# EAGLE design final (EAGLE 6.4)
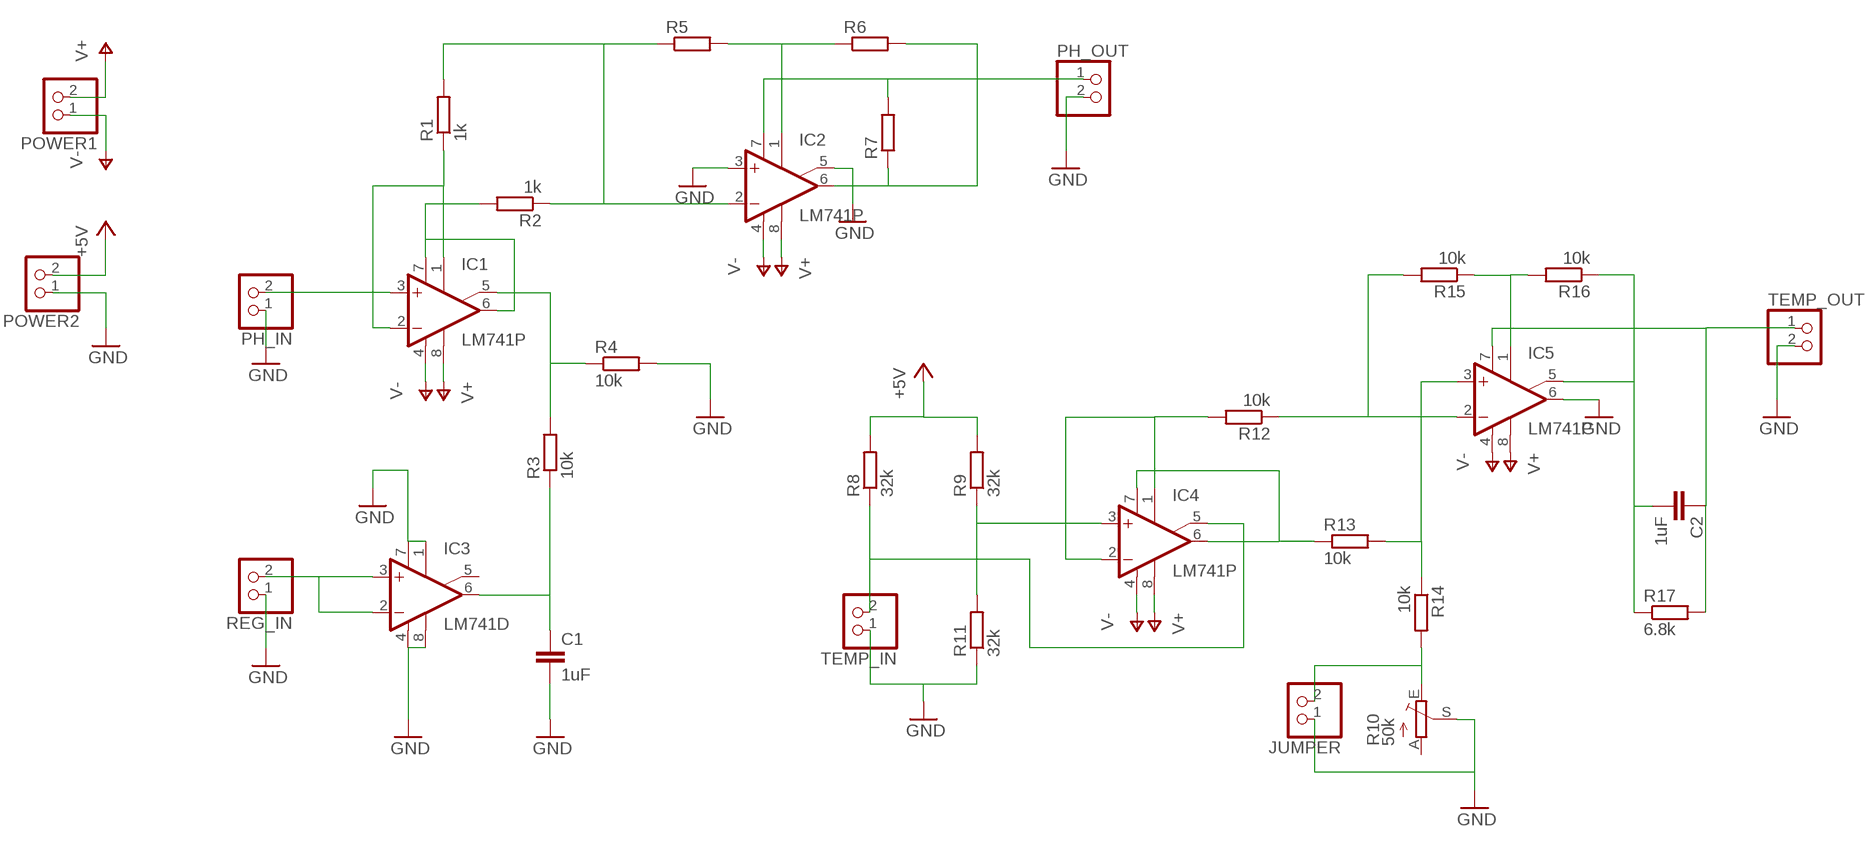
[diagram p0: schematic, sheet 1]

## Parts
C1  1uF  C-EUC0805K  [C0805K]
C2  1uF  C-EUC0805K  [C0805K]
IC1  LM741P  [DIL08]
IC2  LM741P  [DIL08]
IC3  LM741D  [SO08]
IC4  LM741P  [DIL08]
IC5  LM741P  [DIL08]
JUMPER  PINHD-1X2  [1X02]
PH_IN  PINHD-1X2  [1X02]
PH_OUT  PINHD-1X2  [1X02]
POWER1  PINHD-1X2  [1X02]
POWER2  PINHD-1X2  [1X02]
R1  1k  R-EU_R0805  [R0805]
R2  1k  R-EU_R0805  [R0805]
R3  10k  R-EU_R0805  [R0805]
R4  10k  R-EU_R0805  [R0805]
R5  R-EU_R0805  [R0805]
R6  R-EU_R0805  [R0805]
R7  R-EU_R0805  [R0805]
R8  32k  R-EU_R0805  [R0805]
R9  32k  R-EU_R0805  [R0805]
R10  50k  TRIM_EU-S64W  [S64W]
R11  32k  R-EU_R0805  [R0805]
R12  10k  R-EU_R0805  [R0805]
R13  10k  R-EU_R0805  [R0805]
R14  10k  R-EU_R0805  [R0805]
R15  10k  R-EU_R0805  [R0805]
R16  10k  R-EU_R0805  [R0805]
R17  6.8k  R-EU_R0805  [R0805]
REG_IN  PINHD-1X2  [1X02]
TEMP_IN  PINHD-1X2  [1X02]
TEMP_OUT  PINHD-1X2  [1X02]

## Nets
+5V: POWER2.2 R8.2 R9.2
GND: C1.2 IC2.3(+IN) IC2.5(ON2) IC3.1(ON1) IC3.4(V-) IC3.7(V+) IC3.8(OPT) IC5.6(OUT) JUMPER.1 PH_IN.1 PH_OUT.2 POWER2.1 R4.2 R10.S R11.1 REG_IN.1 TEMP_IN.1 TEMP_OUT.2
N$1: IC1.1(ON1) IC1.2(-IN) R1.1
N$2: IC1.3(+IN) PH_IN.2
N$3: IC2.2(-IN) R1.2 R2.1 R5.1
N$4: IC1.6(OUT) IC1.7(V+) R2.2
N$5: IC3.2(-IN) IC3.3(+IN) REG_IN.2
N$6: IC1.5(ON2) R3.2 R4.1
N$7: IC2.1(ON1) R5.2 R6.1
N$8: C1.1 IC3.6(OUT) R3.1
N$9: IC2.6(OUT) R6.2 R7.1
N$10: IC2.7(V+) PH_OUT.1 R7.2
N$11: IC4.5(ON2) R8.1 TEMP_IN.2
N$12: IC4.3(+IN) R9.1 R11.2
N$13: IC5.1(ON1) R15.1 R16.2
N$14: JUMPER.2 R10.E R14.2
N$15: C2.1 IC5.7(V+) R17.2 TEMP_OUT.1
N$16: IC4.1(ON1) IC4.2(-IN) R12.2
N$17: IC4.6(OUT) IC4.7(V+) R13.1
N$18: C2.2 IC5.5(ON2) R16.1 R17.1
N$19: IC5.3(+IN) R13.2 R14.1
N$20: IC5.2(-IN) R12.1 R15.2
V+: IC1.8(OPT) IC2.8(OPT) IC4.8(OPT) IC5.8(OPT) POWER1.2
V-: IC1.4(V-) IC2.4(V-) IC4.4(V-) IC5.4(V-) POWER1.1
Unconnected: IC3.5(ON2) R10.A

## Library data of the parts
C1 C2 = resistor:C-EU: CAPACITOR, European symbol
IC1-IC5 = linear:*741: OP AMP
JUMPER PH_IN PH_OUT POWER1 POWER2 REG_IN TEMP_IN TEMP_OUT = pinhead:PINHD-1X2: PIN HEADER
R1-R9 R11-R17 = resistor:R-EU_: RESISTOR, European symbol
R10 = pot:TRIM_EU-: POTENTIOMETER

## Board
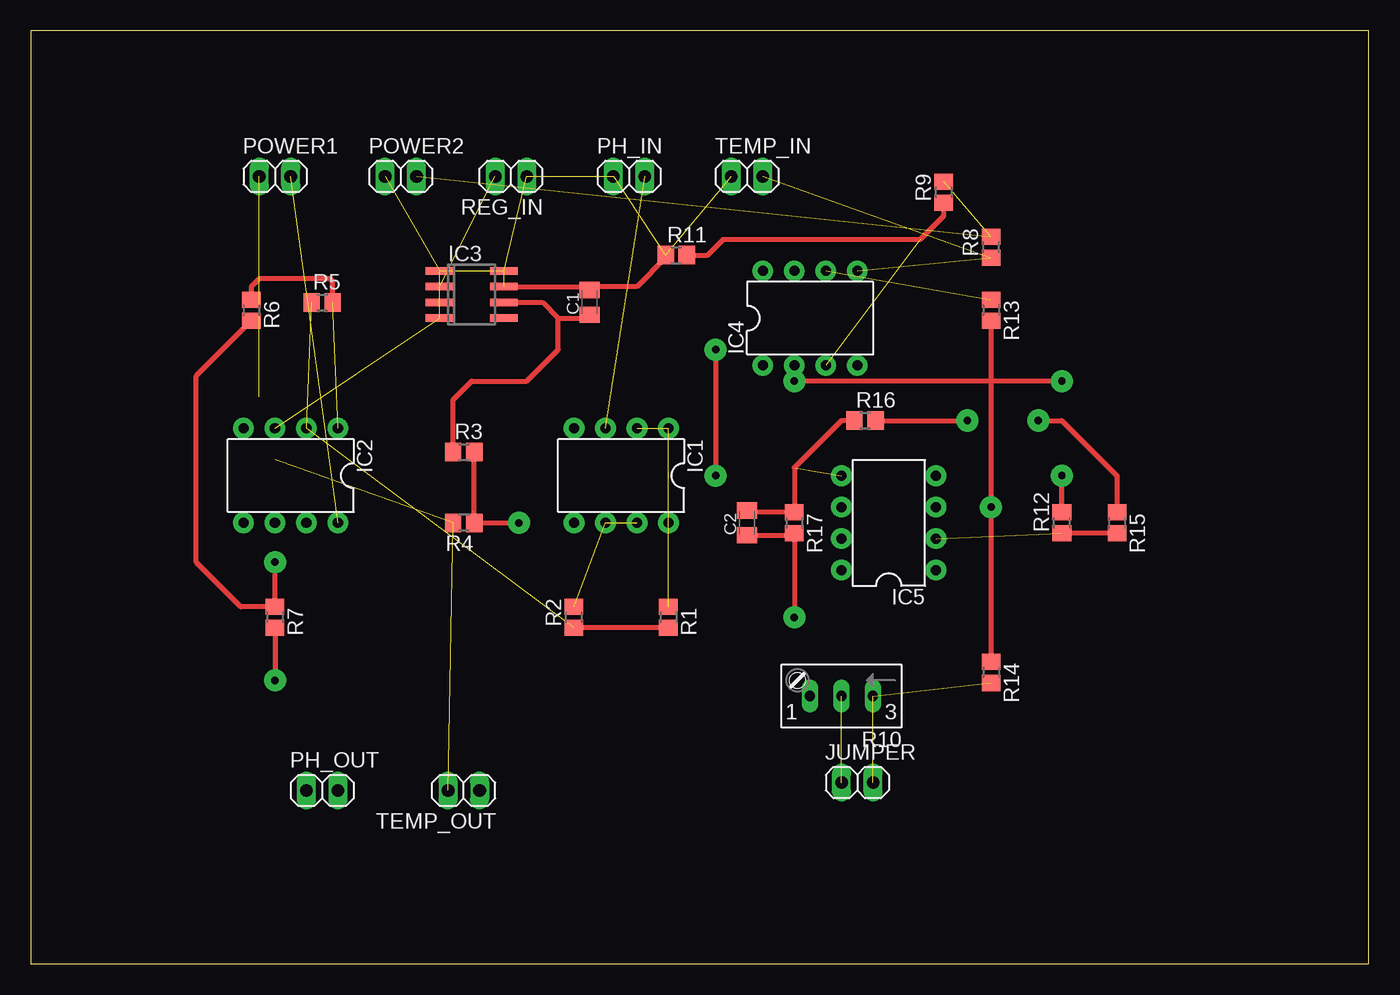
[diagram p1: board, top side]
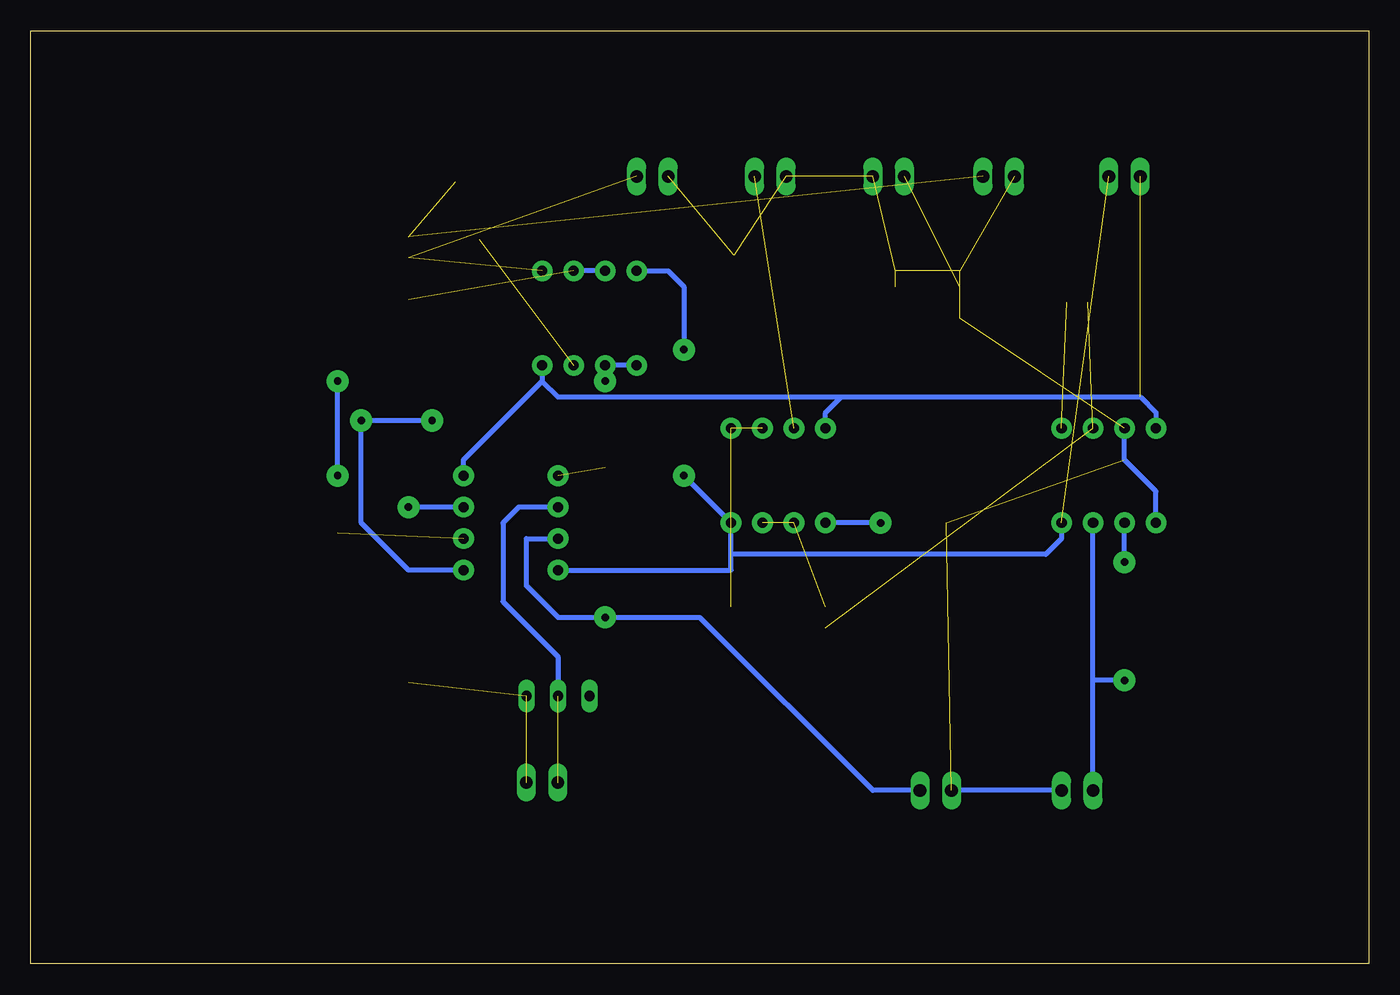
[diagram p2: board, bottom side, seen from below]

Size 107.93 x 75.23 mm. Coordinates in mm from the lower left corner, seen from the top.
Outline: 0,0 107.93,0 107.93,75.23 0,75.23 0,0
Copper layers (1*16): Top 0.035mm / dielectric 1.5mm / Bottom 0.035mm
Design rules "default": minimum track width 10mil, minimum drill 24mil, track to track 8mil, track to pad 8mil, pad to pad 8mil, via to via 8mil, smd to smd 8mil, copper to edge 40mil, drill to drill 8mil, minimum pad ring 10mil, minimum via ring 8mil, stop-mask expansion 4mil, vias tented up to drill 0mil, thermal gap 10mil

### Footprints (pad centres in the part's own frame; a part is rotated, then mirrored left to right if it is on the bottom)
C0805K = smd 1.3 x 1.6: 1 -1,0; 2 1,0
DIL08 = drill 0.813 pad 1.676: 1 -3.81,-3.81; 2 -1.27,-3.81; 3 1.27,-3.81; 4 3.81,-3.81; 5 3.81,3.81; 6 1.27,3.81; 7 -1.27,3.81; 8 -3.81,3.81
SO08 = smd 0.6 x 2.2: 1 -1.905,-2.6; 2 -0.635,-2.6; 3 0.635,-2.6; 4 1.905,-2.6; 5 1.905,2.6; 6 0.635,2.6; 7 -0.635,2.6; 8 -1.905,2.6
1X02 = drill 1.016 long: 1 -1.27,0; 2 1.27,0
R0805 = smd 1.3 x 1.5: 1 -0.85,0; 2 0.85,0
S64W = drill 0.813 long: A 2.54,1.27; E -2.54,1.27; S 0,1.27

### Placement (x,y rotation side)
C1  45.09,53.34 90 top
C2  57.78,35.56 90 top
IC1  47.62,39.37 180 top
IC2  20.95,39.37 180 top
IC3  35.56,53.98 270 top
IC4  62.87,52.07 0 top
IC5  69.22,35.56 90 top
JUMPER  66.67,14.61 0 top
PH_IN  48.26,63.5 0 top
PH_OUT  23.5,13.97 0 top
POWER1  19.68,63.5 0 top
POWER2  29.84,63.5 0 top
R1  51.44,27.94 270 top
R2  43.81,27.94 90 top
R3  34.92,41.27 0 top
R4  34.92,35.56 180 top
R5  23.5,53.34 0 top
R6  17.78,52.7 270 top
R7  19.68,27.94 270 top
R8  77.47,57.78 90 top
R9  73.66,62.23 90 top
R10  65.41,22.86 180 top
R11  52.07,57.15 0 top
R12  83.19,35.56 90 top
R13  77.47,52.7 270 top
R14  77.47,23.5 270 top
R15  87.63,35.56 270 top
R16  67.31,43.81 0 top
R17  61.59,35.56 270 top
REG_IN  38.73,63.5 180 top
TEMP_IN  57.78,63.5 0 top
TEMP_OUT  34.92,13.97 180 top

### Tracks (layer width: path | path; a pad name or v marks a point on that pad's centre or on a via)
+5V  (2 unrouted)
GND  (12 unrouted)
  Top 0.406: R11.1 51.22,56.94 48.9,54.61 45.35,54.61 C1.2 44.81,54.61 IC3.7
  Bottom 0.406: IC2.5 17.14,38.1 19.68,40.64 IC2.3 | PH_OUT.2 TEMP_OUT.2 | IC5.6 68.58,36.83 69.85,35.56 69.85,29.21 65.41,24.77 R10.S
N$1  (2 unrouted)
N$2  (1 unrouted)
N$3  (2 unrouted)
  Top 0.406: R1.2 R2.1
N$4  (2 unrouted)
N$5  (2 unrouted)
N$6  (via drill 0.6 pad 1.78)
  Top 0.406: R3.2 R4.1 v39.37,35.56
  Bottom 0.406: v39.37,35.56 IC1.5
N$7  (1 unrouted)
  Top 0.406: R5.2 24.34,55.03 24.13,55.24 18.41,55.24 17.78,54.61 R6.1
N$8
  Top 0.406: IC3.6 41.27,53.34 42.55,52.07 | 42.55,52.07 44.81,52.07 C1.1 | R3.1 34.08,45.51 35.56,46.99 40.01,46.99 42.55,49.53 42.55,52.07
N$9  (via drill 0.6 pad 1.78)
  Top 0.406: R6.2 13.34,47.41 13.34,32.38 16.93,28.79 R7.1 v19.68,32.38
  Bottom 0.406: v19.68,32.38 IC2.6
N$10  (via drill 0.6 pad 1.78)
  Top 0.406: R7.2 v19.68,22.86
  Bottom 0.406: PH_OUT.1 22.23,22.86 | 22.23,22.86 IC2.7 | v19.68,22.86 22.23,22.86
N$11  (2 unrouted)
N$12  (1 unrouted)
  Top 0.406: R11.2 54.61,57.15 55.88,58.42 71.75,58.42 73.66,60.33 R9.1
N$13  (via drill 0.6 pad 1.78)
  Top 0.406: R16.2 v75.56,43.81 | v81.28,43.81 83.19,43.81 87.63,39.37 R15.1
  Bottom 0.406: v75.56,43.81 v81.28,43.81 81.28,35.56 77.47,31.75 IC5.1
N$14  (2 unrouted)
N$15  (via drill 0.6 pad 1.78)
  Top 0.406: C2.1 61.45,34.56 R17.2 v61.59,27.94
  Bottom 0.406: TEMP_OUT.1 40.01,13.97 53.98,27.94 v61.59,27.94 65.41,27.94 67.94,30.48 67.94,34.29 IC5.7
N$16  (via drill 0.6 pad 1.78)
  Top 0.406: R12.2 v83.19,39.37 | v83.19,46.99 v61.59,46.99
  Bottom 0.406: IC4.1 IC4.2 v61.59,46.99 | v83.19,39.37 v83.19,46.99
N$17  (1 unrouted)
  Bottom 0.406: IC4.7 IC4.6
N$18  (1 unrouted)
  Top 0.406: R16.1 65.41,43.81 61.59,40.01 R17.1 57.94,36.41 C2.2
N$19  (via drill 0.6 pad 1.78)
  Top 0.406: R14.1 v77.47,36.83 R13.2
  Bottom 0.406: IC5.3 v77.47,36.83
N$20  (1 unrouted)
  Top 0.406: R15.2 R12.1
V+  (via drill 0.6 pad 1.78)  (1 unrouted)
  Top 0.406: v55.24,49.53 v55.24,39.37
  Bottom 0.406: IC2.8 24.77,34.29 26.04,33.02 51.44,33.02 | IC5.8 51.44,31.75 51.44,33.02 | 51.44,33.02 IC1.8 v55.24,39.37 | IC4.8 56.52,55.88 55.24,54.61 v55.24,49.53
V-  (1 unrouted)
  Bottom 0.406: IC1.4 43.81,44.45 42.55,45.72 | 42.55,45.72 18.41,45.72 17.14,44.45 IC2.4 | IC4.4 66.67,46.99 | 66.67,46.99 65.41,45.72 42.55,45.72 | IC5.4 73.03,40.64 66.67,46.99